# Altium schematic sheet Switches.SchDoc: Mechanical Switches
size A; Author: Parth Thakkar; Organization: Low Self Esteam; Revision: v1.0; SheetNumber: 6; SheetTotal: 8
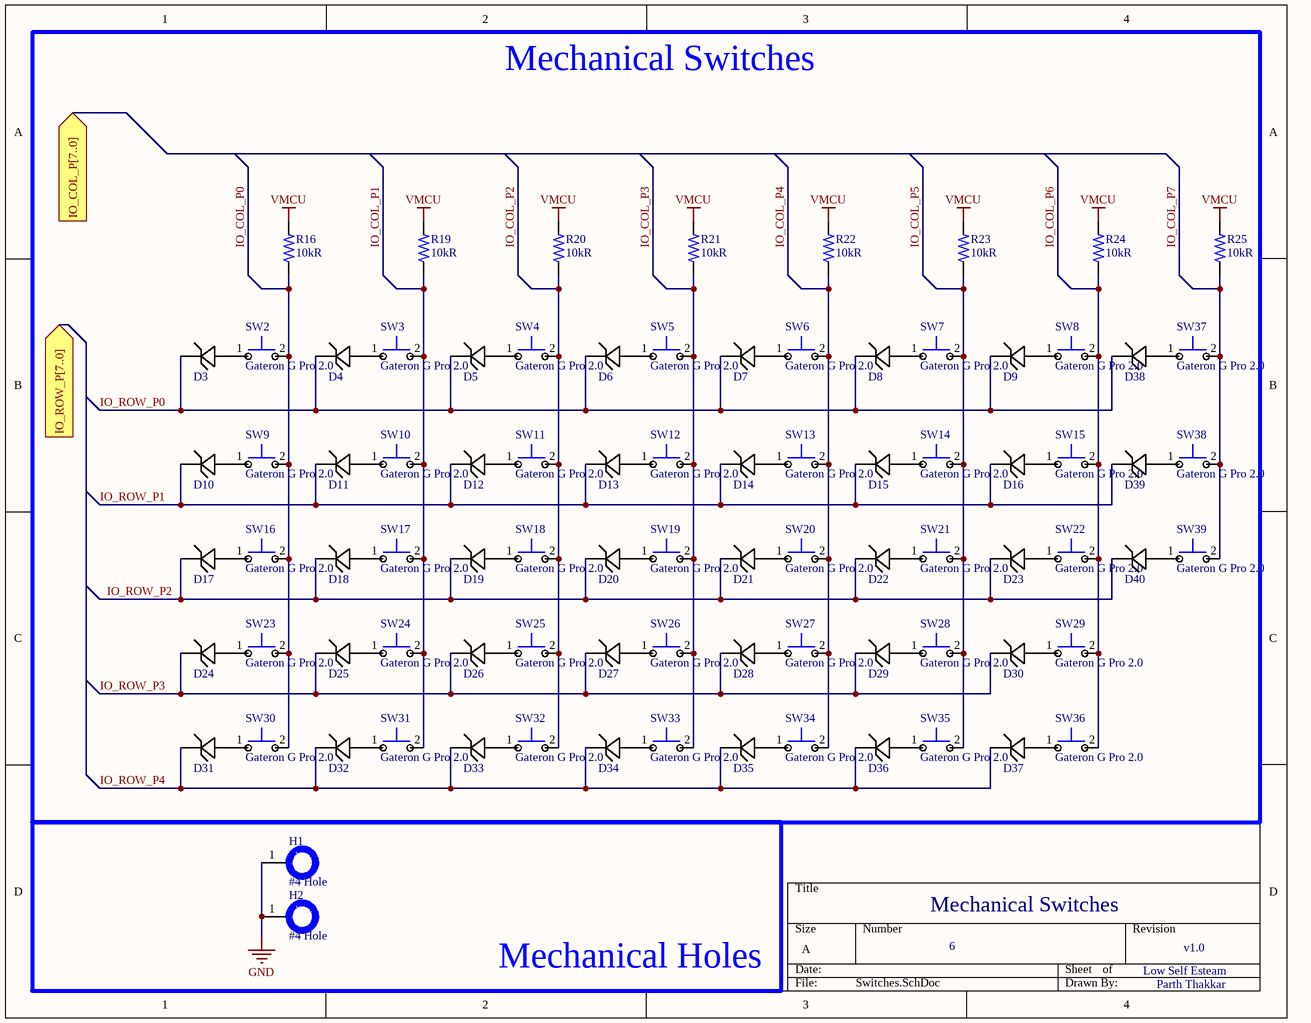
[diagram p0: Switches.SchDoc]

## Parts
D3  Diode Schottky  [Diode Schottky]  (value not drawn)
D4  Diode Schottky  [Diode Schottky]  (value not drawn)
D5  Diode Schottky  [Diode Schottky]  (value not drawn)
D6  Diode Schottky  [Diode Schottky]  (value not drawn)
D7  Diode Schottky  [Diode Schottky]  (value not drawn)
D8  Diode Schottky  [Diode Schottky]  (value not drawn)
D9  Diode Schottky  [Diode Schottky]  (value not drawn)
D10  Diode Schottky  [Diode Schottky]  (value not drawn)
D11  Diode Schottky  [Diode Schottky]  (value not drawn)
D12  Diode Schottky  [Diode Schottky]  (value not drawn)
D13  Diode Schottky  [Diode Schottky]  (value not drawn)
D14  Diode Schottky  [Diode Schottky]  (value not drawn)
D15  Diode Schottky  [Diode Schottky]  (value not drawn)
D16  Diode Schottky  [Diode Schottky]  (value not drawn)
D17  Diode Schottky  [Diode Schottky]  (value not drawn)
D18  Diode Schottky  [Diode Schottky]  (value not drawn)
D19  Diode Schottky  [Diode Schottky]  (value not drawn)
D20  Diode Schottky  [Diode Schottky]  (value not drawn)
D21  Diode Schottky  [Diode Schottky]  (value not drawn)
D22  Diode Schottky  [Diode Schottky]  (value not drawn)
D23  Diode Schottky  [Diode Schottky]  (value not drawn)
D24  Diode Schottky  [Diode Schottky]  (value not drawn)
D25  Diode Schottky  [Diode Schottky]  (value not drawn)
D26  Diode Schottky  [Diode Schottky]  (value not drawn)
D27  Diode Schottky  [Diode Schottky]  (value not drawn)
D28  Diode Schottky  [Diode Schottky]  (value not drawn)
D29  Diode Schottky  [Diode Schottky]  (value not drawn)
D30  Diode Schottky  [Diode Schottky]  (value not drawn)
D31  Diode Schottky  [Diode Schottky]  (value not drawn)
D32  Diode Schottky  [Diode Schottky]  (value not drawn)
D33  Diode Schottky  [Diode Schottky]  (value not drawn)
D34  Diode Schottky  [Diode Schottky]  (value not drawn)
D35  Diode Schottky  [Diode Schottky]  (value not drawn)
D36  Diode Schottky  [Diode Schottky]  (value not drawn)
D37  Diode Schottky  [Diode Schottky]  (value not drawn)
D38  Diode Schottky  [Diode Schottky]  (value not drawn)
D39  Diode Schottky  [Diode Schottky]  (value not drawn)
D40  Diode Schottky  [Diode Schottky]  (value not drawn)
H1  #4 Hole  [Hole]  (no BOM)
H2  #4 Hole  [Hole]  (no BOM)
R16  value 10kR  [Resistor 0603]  (hidden comment: RES 10K 0603)
R19  value 10kR  [Resistor 0603]  (hidden comment: RES 10K 0603)
R20  value 10kR  [Resistor 0603]  (hidden comment: RES 10K 0603)
R21  value 10kR  [Resistor 0603]  (hidden comment: RES 10K 0603)
R22  value 10kR  [Resistor 0603]  (hidden comment: RES 10K 0603)
R23  value 10kR  [Resistor 0603]  (hidden comment: RES 10K 0603)
R24  value 10kR  [Resistor 0603]  (hidden comment: RES 10K 0603)
R25  value 10kR  [Resistor 0603]  (hidden comment: RES 10K 0603)
SW2  Gateron G Pro 2.0  [Mechanical Switch]
SW3  Gateron G Pro 2.0  [Mechanical Switch]
SW4  Gateron G Pro 2.0  [Mechanical Switch]
SW5  Gateron G Pro 2.0  [Mechanical Switch]
SW6  Gateron G Pro 2.0  [Mechanical Switch]
SW7  Gateron G Pro 2.0  [Mechanical Switch]
SW8  Gateron G Pro 2.0  [Mechanical Switch]
SW9  Gateron G Pro 2.0  [Mechanical Switch]
SW10  Gateron G Pro 2.0  [Mechanical Switch]
SW11  Gateron G Pro 2.0  [Mechanical Switch]
SW12  Gateron G Pro 2.0  [Mechanical Switch]
SW13  Gateron G Pro 2.0  [Mechanical Switch]
SW14  Gateron G Pro 2.0  [Mechanical Switch]
SW15  Gateron G Pro 2.0  [Mechanical Switch]
SW16  Gateron G Pro 2.0  [Mechanical Switch]
SW17  Gateron G Pro 2.0  [Mechanical Switch]
SW18  Gateron G Pro 2.0  [Mechanical Switch]
SW19  Gateron G Pro 2.0  [Mechanical Switch]
SW20  Gateron G Pro 2.0  [Mechanical Switch]
SW21  Gateron G Pro 2.0  [Mechanical Switch]
SW22  Gateron G Pro 2.0  [Mechanical Switch]
SW23  Gateron G Pro 2.0  [Mechanical Switch]
SW24  Gateron G Pro 2.0  [Mechanical Switch]
SW25  Gateron G Pro 2.0  [Mechanical Switch]
SW26  Gateron G Pro 2.0  [Mechanical Switch]
SW27  Gateron G Pro 2.0  [Mechanical Switch]
SW28  Gateron G Pro 2.0  [Mechanical Switch]
SW29  Gateron G Pro 2.0  [Mechanical Switch]
SW30  Gateron G Pro 2.0  [Mechanical Switch]
SW31  Gateron G Pro 2.0  [Mechanical Switch]
SW32  Gateron G Pro 2.0  [Mechanical Switch]
SW33  Gateron G Pro 2.0  [Mechanical Switch]
SW34  Gateron G Pro 2.0  [Mechanical Switch]
SW35  Gateron G Pro 2.0  [Mechanical Switch]
SW36  Gateron G Pro 2.0  [Mechanical Switch]
SW37  Gateron G Pro 2.0  [Mechanical Switch]
SW38  Gateron G Pro 2.0  [Mechanical Switch]
SW39  Gateron G Pro 2.0  [Mechanical Switch]

## Blocks framed on the sheet
Mechanical Switches: D3-D40 R16 R19-R25 SW2-SW39
Mechanical Holes: H1 H2

## Ports
IO_COL_P[7..0] (in, see 1[4B], 4[1A]), IO_ROW_P[7..0] (in, see 1[4B], 4[1A])

## Nets
GND: H1.1 H2.1
VMCU: R16.2 R19.2 R20.2 R21.2 R22.2 R23.2 R24.2 R25.2
IO_COL_P0: R16.1 SW2.2 SW9.2 SW16.2 SW23.2 SW30.2
IO_COL_P1: R19.1 SW3.2 SW10.2 SW17.2 SW24.2 SW31.2
IO_COL_P2: R20.1 SW4.2 SW11.2 SW18.2 SW25.2 SW32.2
IO_COL_P3: R21.1 SW5.2 SW12.2 SW19.2 SW26.2 SW33.2
IO_COL_P4: R22.1 SW6.2 SW13.2 SW20.2 SW27.2 SW34.2
IO_COL_P5: R23.1 SW7.2 SW14.2 SW21.2 SW28.2 SW35.2
IO_COL_P6: R24.1 SW8.2 SW15.2 SW22.2 SW29.2 SW36.2
IO_COL_P7: R25.1 SW37.2 SW38.2 SW39.2
IO_ROW_P0: D3.1 D4.1 D5.1 D6.1 D7.1 D8.1 D9.1 D38.1
IO_ROW_P1: D10.1 D11.1 D12.1 D13.1 D14.1 D15.1 D16.1 D39.1
IO_ROW_P2: D17.1 D18.1 D19.1 D20.1 D21.1 D22.1 D23.1 D40.1
IO_ROW_P3: D24.1 D25.1 D26.1 D27.1 D28.1 D29.1 D30.1
IO_ROW_P4: D31.1 D32.1 D33.1 D34.1 D35.1 D36.1 D37.1
NetD3_2: D3.2 SW2.1
NetD4_2: D4.2 SW3.1
NetD5_2: D5.2 SW4.1
NetD6_2: D6.2 SW5.1
NetD7_2: D7.2 SW6.1
NetD8_2: D8.2 SW7.1
NetD9_2: D9.2 SW8.1
NetD10_2: D10.2 SW9.1
NetD11_2: D11.2 SW10.1
NetD12_2: D12.2 SW11.1
NetD13_2: D13.2 SW12.1
NetD14_2: D14.2 SW13.1
NetD15_2: D15.2 SW14.1
NetD16_2: D16.2 SW15.1
NetD17_2: D17.2 SW16.1
NetD18_2: D18.2 SW17.1
NetD19_2: D19.2 SW18.1
NetD20_2: D20.2 SW19.1
NetD21_2: D21.2 SW20.1
NetD22_2: D22.2 SW21.1
NetD23_2: D23.2 SW22.1
NetD24_2: D24.2 SW23.1
NetD25_2: D25.2 SW24.1
NetD26_2: D26.2 SW25.1
NetD27_2: D27.2 SW26.1
NetD28_2: D28.2 SW27.1
NetD29_2: D29.2 SW28.1
NetD30_2: D30.2 SW29.1
NetD31_2: D31.2 SW30.1
NetD32_2: D32.2 SW31.1
NetD33_2: D33.2 SW32.1
NetD34_2: D34.2 SW33.1
NetD35_2: D35.2 SW34.1
NetD36_2: D36.2 SW35.1
NetD37_2: D37.2 SW36.1
NetD38_2: D38.2 SW37.1
NetD39_2: D39.2 SW38.1
NetD40_2: D40.2 SW39.1

## Library data of the parts
D3-D40 = Diode Schottky: Rectifier Diode, Schottky, 1 Phase, 1 Element, 1A, 15V V(RRM), Silicon, DO-214BA; Manufacturer: Microchip; Manufacturer Part Number: LSM115JE3/TR13; Value: 150pF; Element Configuration: 5460ElementConfiguration; Forward Voltage: 220mV; Max Forward Surge Current (Ifsm): 50A; Max Reverse Current: 10mA; Supplier: Digikey; Supplier Part Number: 150-LSM115JE3/TR13CT-ND; RoHS: Yes; Category: Rectifier Diodes; Stock: 87281; Pricing: 1=0.55, 100=0.5 (USD); Mounting Technology: 8Mount; Pins: 2NUMBER; Weight: 103.986051mg; Min Operating Temperature: -55°C; Max Operating Temperature: 100°C; Average Rectified Current: 1A; Forward Current: 1A; Packaging: 10Packaging; Max Repetitive Reverse Voltage (Vrrm): 15V; Max Reverse Voltage (DC): 15V; Peak Non-Repetitive Surge Current: 50A; Reverse Voltage: 15V; Reverse Voltage (DC): 15V; Height: 2.92mm; Radiation Hardening: 5898YesNo; Lead Free: 5697LeadFree; ComponentLink1URL: https://datasheet.octopart.com/LSM115JE3-TR13-Microchip-datasheet-175858636.pdf?src-supplier=microchipDIRECT; ComponentLink1Description: https://datasheet.octopart.com/LSM115JE3-TR13-Microchip-datasheet-175858636.pdf?src-supplier=microchipDIRECT; ComponentLink2URL: https://datasheet.octopart.com/LSM115JE3-TR13-Microchip-datasheet-175858635.pdf?src-supplier=Master+Electronics; ComponentLink2Description: https://datasheet.octopart.com/LSM115JE3-TR13-Microchip-datasheet-175858635.pdf?src-supplier=Master+Electronics
H1 H2 = HOLE_#4
R16 R19-R25 = RES 10K 0603: Fixed Resistor, Metal Glaze/thick Film, 0.1W, 10000ohm, 75V, 1% +/-Tol, 100ppm/Cel, Surface Mount, 0603; Manufacturer: Yageo; Manufacturer Part Number: RC0603FR-0710KL; Additional Feature: LASER TRIMMABLE; Power: 100mW; Rated Temperature: 70°C; Temperature Coefficient: 100ppm/°C; Package Height: 0.45mm; Package Length: 1.6mm; Package Width: 0.8mm; Supplier: Digikey; Supplier Part Number: 311-10.0KHRCT-ND; RoHS: Yes; Category: Chip SMD Resistors; Stock: 6878448; Pricing: 1=0.1, 10=0.019, 50=0.0112, 100=0.0093, 500=0.00622, 1000=0.00532, 5000=0.00382, 10000=0.00335, 25000=0.00287, 35000=0.00278, 50000=0.00257, 125000=0.00232 (USD); Mounting Technology: Surface Mount; Pins: 2; Package Shape: Rectangular; Case/Package: 0603; Terminal Finish: Nickel; Min Operating Temperature: -55°C; Max Operating Temperature: 155°C; Tolerance: 1%; JESD-609 Code: e3; Resistor Type: FIXED RESISTOR; Construction: Chip; Package Style: SMTMeter; Packaging: Tape and Reel; Technology: METAL GLAZE/THICK FILM; Termination: Wraparound; Working Voltage: 75V; Reach SVHC Compliant: Yes; RoHS Compliant: Yes; ComponentLink1URL: https://datasheet.ciiva.com:443/pdfs/VipMasterIC/IC/YAGO/YAGO-S-A0008145938/YAGO-S-A0008145938-1.pdf?src-supplier=IHS+Markit; ComponentLink1Description: https://datasheet.ciiva.com:443/pdfs/VipMasterIC/IC/YAGO/YAGO-S-A0008145938/YAGO-S-A0008145938-1.pdf?src-supplier=IHS+Markit; ComponentLink2URL: http://www.farnell.com/datasheets/2167052.pdf?src-supplier=Farnell; ComponentLink2Description: http://www.farnell.com/datasheets/2167052.pdf?src-supplier=Farnell; ComponentLink3URL: http://www.farnell.com/datasheets/1868787.pdf?src-supplier=Farnell; ComponentLink3Description: http://www.farnell.com/datasheets/1868787.pdf?src-supplier=Farnell; ComponentLink4URL: http://www.farnell.com/datasheets/443971.pdf?src-supplier=Farnell; ComponentLink4Description: http://www.farnell.com/datasheets/443971.pdf?src-supplier=Farnell; ComponentLink5URL: http://www.yageo.com/documents/recent/PYu-RC_Group_51_RoHS_L_10.pdf?src-supplier=Digikey; ComponentLink5Description: http://www.yageo.com/documents/recent/PYu-RC_Group_51_RoHS_L_10.pdf?src-supplier=Digikey; ComponentLink6URL: http://www.yageo.com/documents/recent/PYu-RC_Group_51_RoHS_L_9.pdf?src-supplier=Component+Sense; ComponentLink6Description: http://www.yageo.com/documents/recent/PYu-RC_Group_51_RoHS_L_9.pdf?src-supplier=Component+Sense
SW2-SW39 = Gateron G Pro 2.0: Gateron G Pro 2.0, The 3-Pin switches are compatible with any 3-Pin/5-Pin MX mechanical keyboard